# Altium schematic sheet Connectors.SchDoc
size A3; SheetNumber: 5; SheetTotal: 5
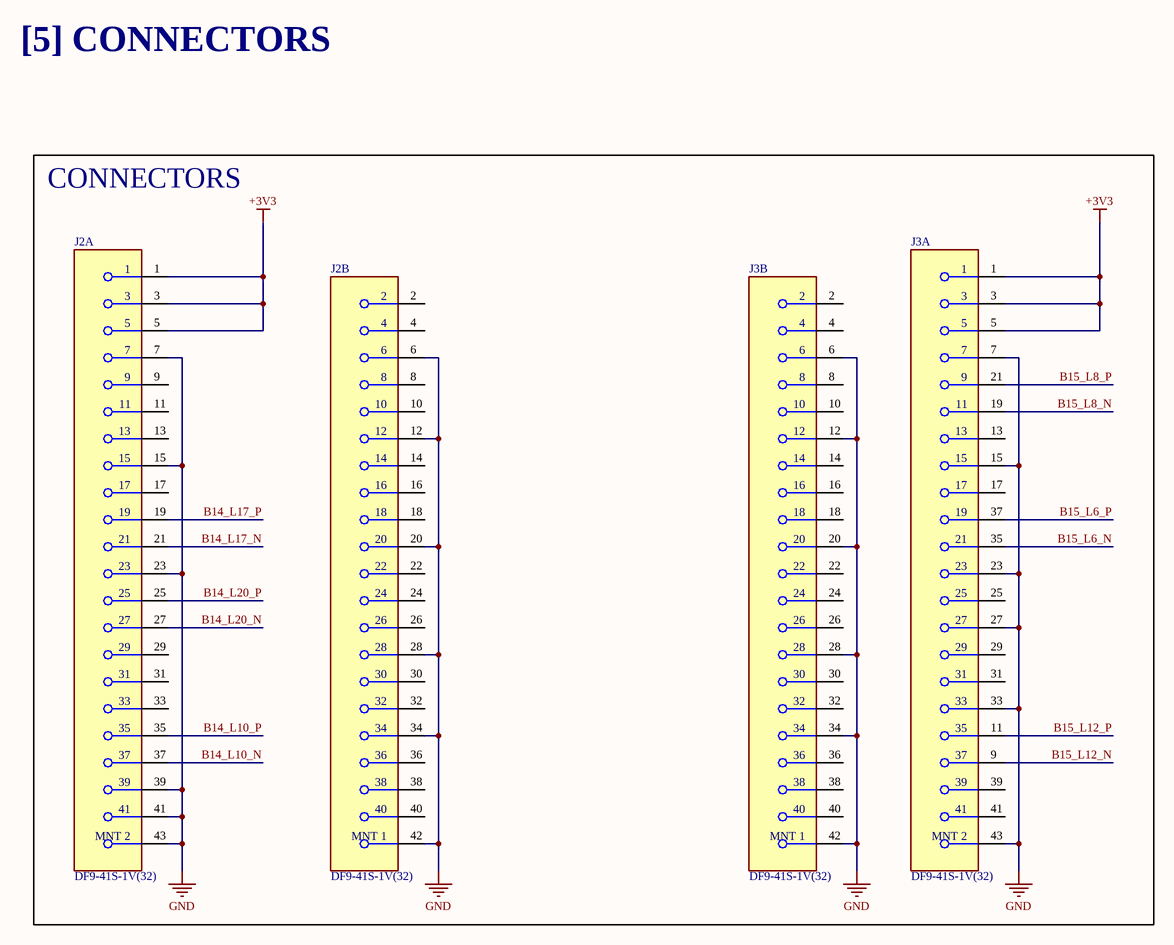
[diagram p0: Connectors.SchDoc]

## Parts
J2  DF9-41S-1V(32)  [FP-DF9-41S-1V_32-MFG]  (parts A,B of 2)
J3  DF9-41S-1V(32)  [FP-DF9-41S-1V_32-MFG]  (parts A,B of 2)

## Blocks framed on the sheet
CONNECTORS: J2 J3

## Nets
+3V3: J2.1 J2.3 J2.5 J3.1 J3.3 J3.5
GND: J2.6 J2.7 J2.12 J2.15 J2.20 J2.23 J2.28 J2.34 J2.39 J2.41 J2.42(MNT_1) J2.43(MNT_2) J3.6 J3.7 J3.12 J3.15 J3.20 J3.23 J3.27 J3.28 J3.33 J3.34 J3.42(MNT_1) J3.43(MNT_2)
B14_L10_N: J2.37
B14_L10_P: J2.35
B14_L17_N: J2.21
B14_L17_P: J2.19
B14_L20_N: J2.27
B14_L20_P: J2.25
B15_L6_N: J3.35
B15_L6_P: J3.37
B15_L8_N: J3.19
B15_L8_P: J3.21
B15_L12_N: J3.9
B15_L12_P: J3.11

Not connected (* = marked no-connect by the designer): J2 2 4 8 9 10 11 13 14 16 17 18 22 24 26 29 30 31 32 33 36 38 40; J3 2 4 8 10 13 14 16 17 18 22 24 25 26 29 30 31 32 36 38 39 40 41

## Notes on the sheet
- [5] CONNECTORS

## Library data of the parts
J2 J3 = CMP-11605-000057-1: CONN RCPT 41POS SMD TIN; Current Rating: 500mA; Voltage Rating: 150V; Connector Type: Receptacle; Number of Positions: 41; Pitch: 1mm; Mated Stacking Heights: 4.3mm; Contact Plating: Tin; Lead Free: Lead Free; Number of Rows: 2; Termination: SMD/SMT; Package Quantity: 1; Number of Contacts: 41; Housing Material: Polyamide; Radiation Hardening: No; REACH SVHC: No SVHC; Flammability Rating: UL94 V-0; Orientation: Straight; Mount: Surface Mount; Packaging: Tape and Reel; Housing Color: Beige; Contact Material: Copper; Gender: Receptacle